# EAGLE design attinier84-motherboard-mk-2.1 (EAGLE 6.5.0)
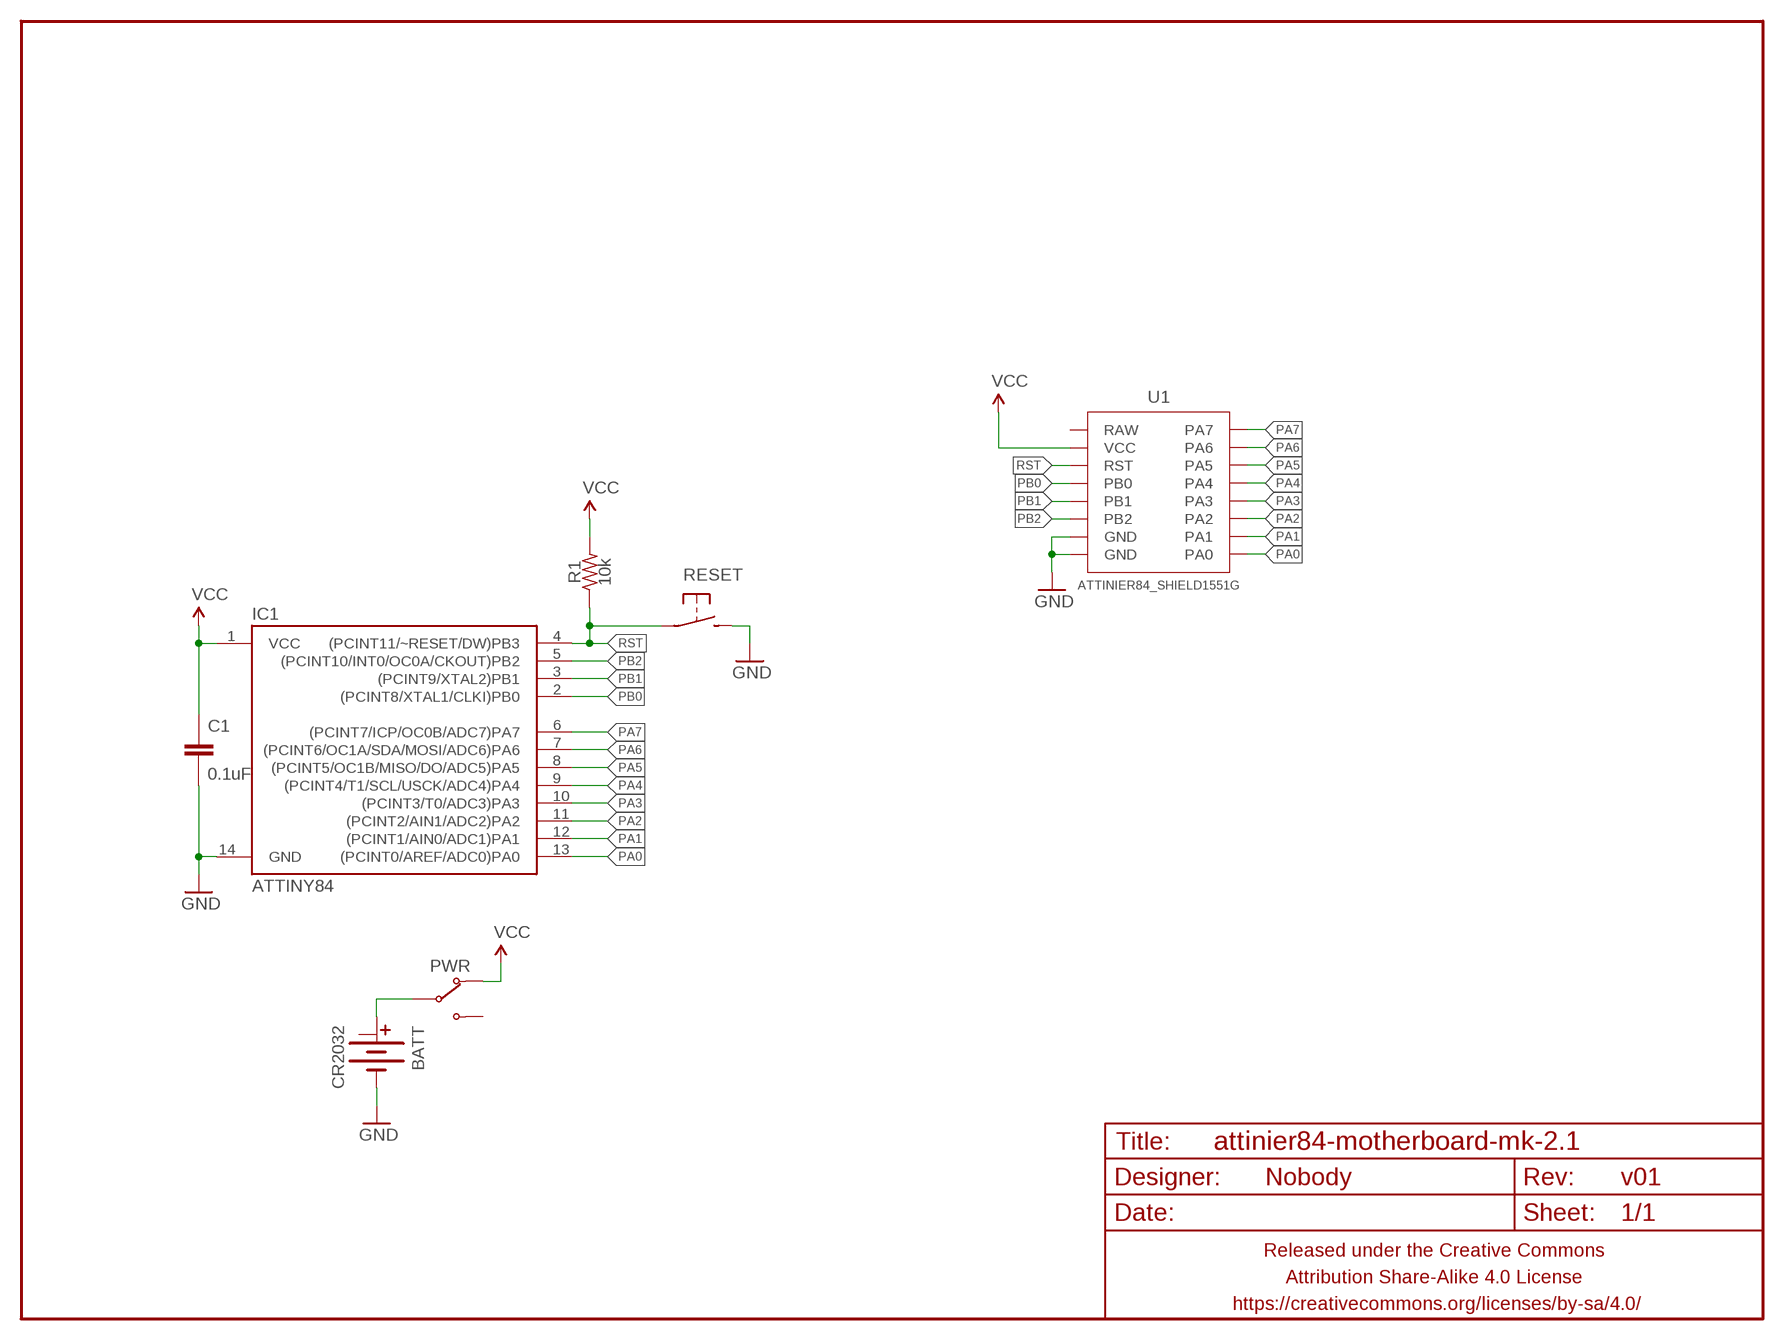
[diagram p0: schematic, sheet 1]

## Parts
BATT  CR2032  BATTERY-COINCR2032_SMD  [BATTCON_20MM_MINE]
C1  0.1uF  CAPACITOR-CERAMICC0805  [C0805]
FRAME1  FRAME-LETTERNO_PACKAGE  [DUMMY]
IC1  ATTINY84  [SO14]
PWR  SWITCH-SPDTPTH-RA-2.54MM  [SPDT-RA-2.54MM]
R1  10k  RESISTORR0805  [R0805]
RESET  SPST-NO-TACT3MM-PTH-SMALL-PADS  [DTS-3-SMALL-PADS]
U1  ATTINIER84_SHIELD1551G  [ATTINIER84_SHIELD2]

## Nets
GND: BATT.BOTTOM(-) C1.2 IC1.14(GND) RESET.2 U1.GND@1(GND) U1.GND@2(GND)
N$1: BATT.TOP@1(+) PWR.2(COM)
PA0: IC1.13((PCINT0/AREF/ADC0)PA0) U1.PA0
PA1: IC1.12((PCINT1/AIN0/ADC1)PA1) U1.PA1
PA2: IC1.11((PCINT2/AIN1/ADC2)PA2) U1.PA2
PA3: IC1.10((PCINT3/T0/ADC3)PA3) U1.PA3
PA4: IC1.9((PCINT4/T1/SCL/USCK/ADC4)PA4) U1.PA4
PA5: IC1.8((PCINT5/OC1B/MISO/DO/ADC5)PA5) U1.PA5
PA6: IC1.7((PCINT6/OC1A/SDA/MOSI/ADC6)PA6) U1.PA6
PA7: IC1.6((PCINT7/ICP/OC0B/ADC7)PA7) U1.PA7
PB0: IC1.2((PCINT8/XTAL1/CLKI)PB0) U1.PB0
PB1: IC1.3((PCINT9/XTAL2)PB1) U1.PB1
PB2: IC1.5((PCINT10/INT0/OC0A/CKOUT)PB2) U1.PB2
RST: IC1.4((PCINT11/~RESET/DW)PB3) R1.1 RESET.1 U1.RST
VCC: C1.1 IC1.1(VCC) PWR.1(NC) R1.2 U1.VCC
Unconnected: BATT.TOP@2(+1) PWR.3(NO) U1.RAW

## Library data of the parts
BATT = A_butts:BATTERY-COIN
C1 = A_butts:CAPACITOR-CERAMIC: CAPACITOR, European symbol
FRAME1 = A_butts:FRAME-LETTER: Schematic Frame Standard 8.5x11 US Letter frame; DESIGNER: Nobody; VERSION: v01
IC1 = A_butts:ATTINY84: Atmel 14-pin 2/4/8kB flash uC
PWR = A_butts:SWITCH-SPDT
R1 = A_butts:RESISTOR: RESISTOR, American symbol
RESET = A_butts:SPST-NO-TACT
U1 = A_butts:ATTINIER84_SHIELD

## Board
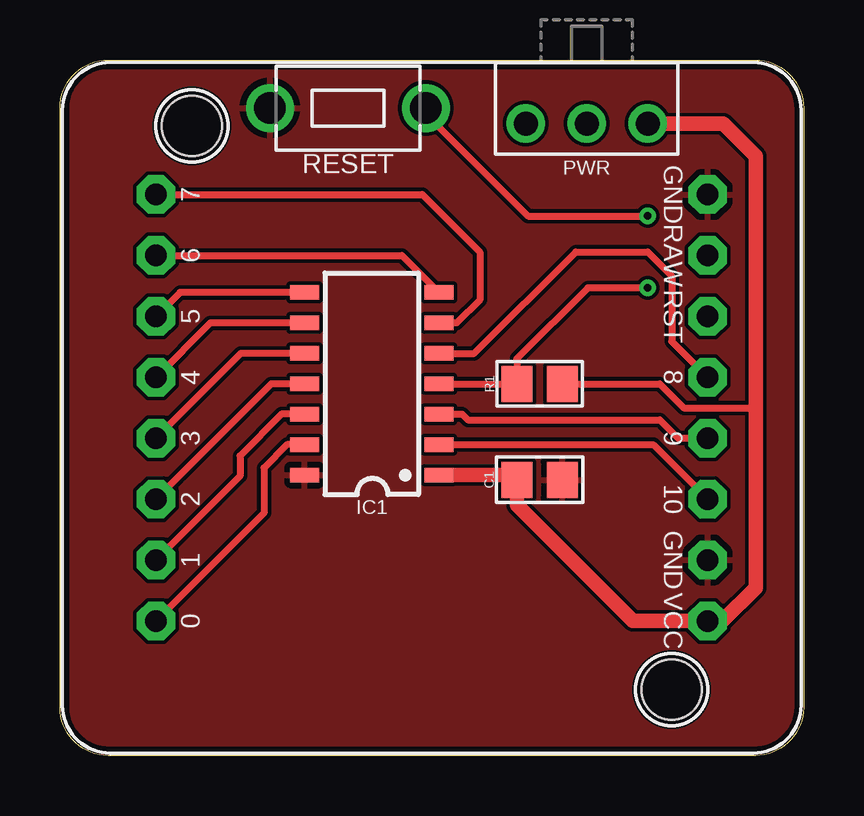
[diagram p1: board, top side]
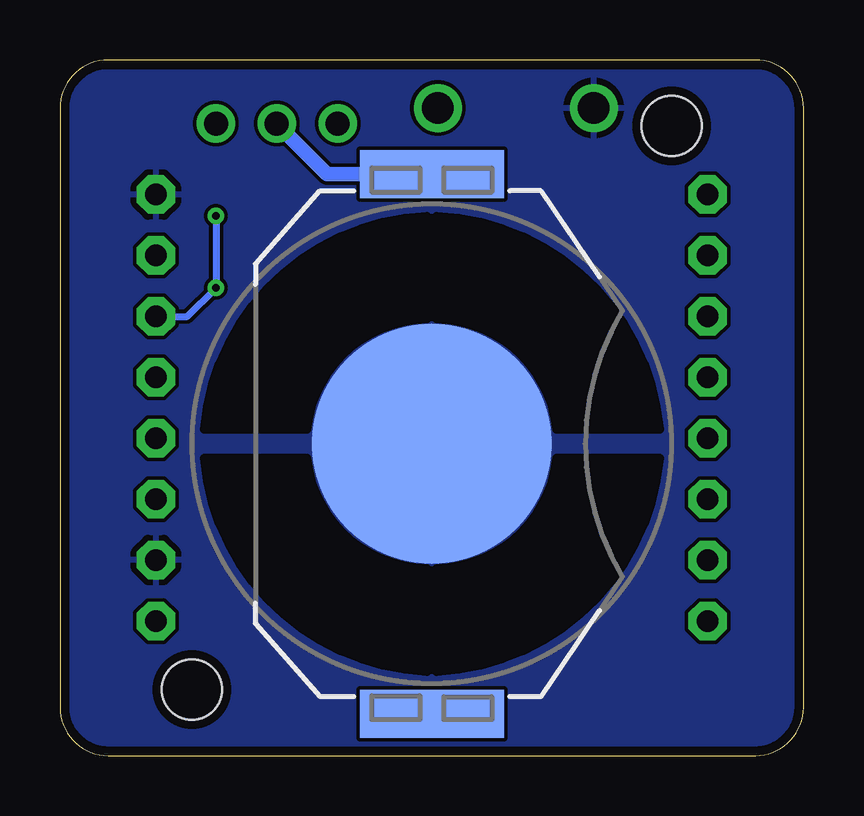
[diagram p2: board, bottom side, seen from below]

Size 31 x 29 mm. Coordinates in mm from the lower left corner, seen from the top.
Copper layers (1*16): Top 0.0356mm / dielectric 1.5011mm / Bottom 0.0356mm
Design rules "LaenPCBOrder_2": minimum track width 6mil, minimum drill 13mil, track to track 6mil, track to pad 6mil, pad to pad 6mil, via to via 6mil, smd to smd 6mil, copper to edge 15mil, drill to drill 6mil, minimum pad ring 7mil, minimum via ring 7mil, stop-mask expansion 3mil, vias tented up to drill 20mil, thermal gap 10mil

### Footprints (pad centres in the part's own frame; a part is rotated, then mirrored left to right if it is on the bottom)
BATTCON_20MM_MINE = smd 10 x 10: BOTTOM 0,0 | smd 6 x 2: TOP@1 0,11.25; TOP@2 0,-11.25
C0805 = smd 1.3 x 1.5: 1 -0.95,0; 2 0.95,0
SO14 = smd 0.6 x 1.2: 1 -3.81,-2.8; 2 -2.54,-2.8; 3 -1.27,-2.8; 4 0,-2.8; 5 1.27,-2.8; 6 2.54,-2.8; 7 3.81,-2.8; 8 3.81,2.8; 9 2.54,2.8; 10 1.27,2.8; 11 0,2.8; 12 -1.27,2.8; 13 -2.54,2.8; 14 -3.81,2.8
SPDT-RA-2.54MM = drill 1 pad 1.6: 1 0,0; 2 2.54,0; 3 5.08,0
R0805 = smd 1.3 x 1.5: 1 -0.95,0; 2 0.95,0
DTS-3-SMALL-PADS = drill 1.3 pad 2: 1 -3.25,0; 2 3.25,0
ATTINIER84_SHIELD2 = drill 0.9 pad 1.6 octagon: GND@1 11.5,-6.35; GND@2 11.5,8.89; PA0 -11.5,-8.89; PA1 -11.5,-6.35; PA2 -11.5,-3.81; PA3 -11.5,-1.27; PA4 -11.5,1.27; PA5 -11.5,3.81; PA6 -11.5,6.35; PA7 -11.5,8.89; PB0 11.5,-3.81; PB1 11.5,-1.27; PB2 11.5,1.27; RAW 11.5,6.35; RST 11.5,3.81; VCC 11.5,-8.89 | hole 2.5: -10,11.75; 10,-11.75

### Placement (x,y rotation side)
BATT  15.5,13 0 bottom
C1  20,11.5 0 top
FRAME1  0,0 0 top
IC1  13,15.5 90 top
PWR  24.5,26.35 180 top
R1  20,15.5 0 top
RESET  12,27 180 top
U1  15.5,14.5 0 top

### Tracks (layer width: path | path; a pad name or v marks a point on that pad's centre or on a via)
GND
  pour Bottom: -0.1,-0.1 -0.1,29.1 31.1,29.1 31.1,-0.1
  pour Top: -0.1,-0.1 -0.1,29.1 31.1,29.1 31.1,-0.1
N$1
  Bottom 0.6: BATT.TOP@1 19.86,24.25 PWR.2
PA0
  Top 0.3: IC1.13 9.46,12.96 8.5,12 8.5,10.11 U1.PA0
PA1
  Top 0.3: IC1.12 9.23,14.23 7.5,12.5 7.5,11.65 U1.PA1
PA2
  Top 0.3: IC1.11 8.81,15.5 U1.PA2
PA3
  Top 0.3: IC1.10 7.54,16.77 U1.PA3
PA4
  Top 0.3: IC1.9 6.27,18.04 U1.PA4
PA5
  Top 0.3: IC1.8 5,19.31 U1.PA5
PA6
  Top 0.3: U1.PA6 14.26,20.85 IC1.7
PA7
  Top 0.3: U1.PA7 15.11,23.39 17.5,21 17.5,19 16.54,18.04 IC1.6
PB0
  Top 0.3: IC1.2 24.73,12.96 U1.PB0
PB1
  Top 0.3: IC1.3 16.77,14.23 17,14 25,14 25.77,13.23 U1.PB1
PB2
  Top 0.3: IC1.5 17.27,16.77 21.5,21 24.5,21 25.5,20 25.5,17.27 U1.PB2
RST  (via drill 0.33)
  Top 0.3: IC1.4 R1.1 19.05,16.55 22,19.5 v24.5,19.5 | RESET.1 15.25,26.75 19.5,22.5 v24.5,22.5
  Bottom 0.3: U1.RST 25.69,18.31 v24.5,19.5 v24.5,22.5
VCC
  Top 0.3: R1.2 25,15.5 26,14.5 29,14.5
  Top 0.6: IC1.1 18.86,11.69 C1.1 19.05,10.45 23.89,5.61 U1.VCC 27.61,5.61 29,7 29,14.5 29,25 27.65,26.35 PWR.1